# EAGLE design rev2 (EAGLE 6.4)
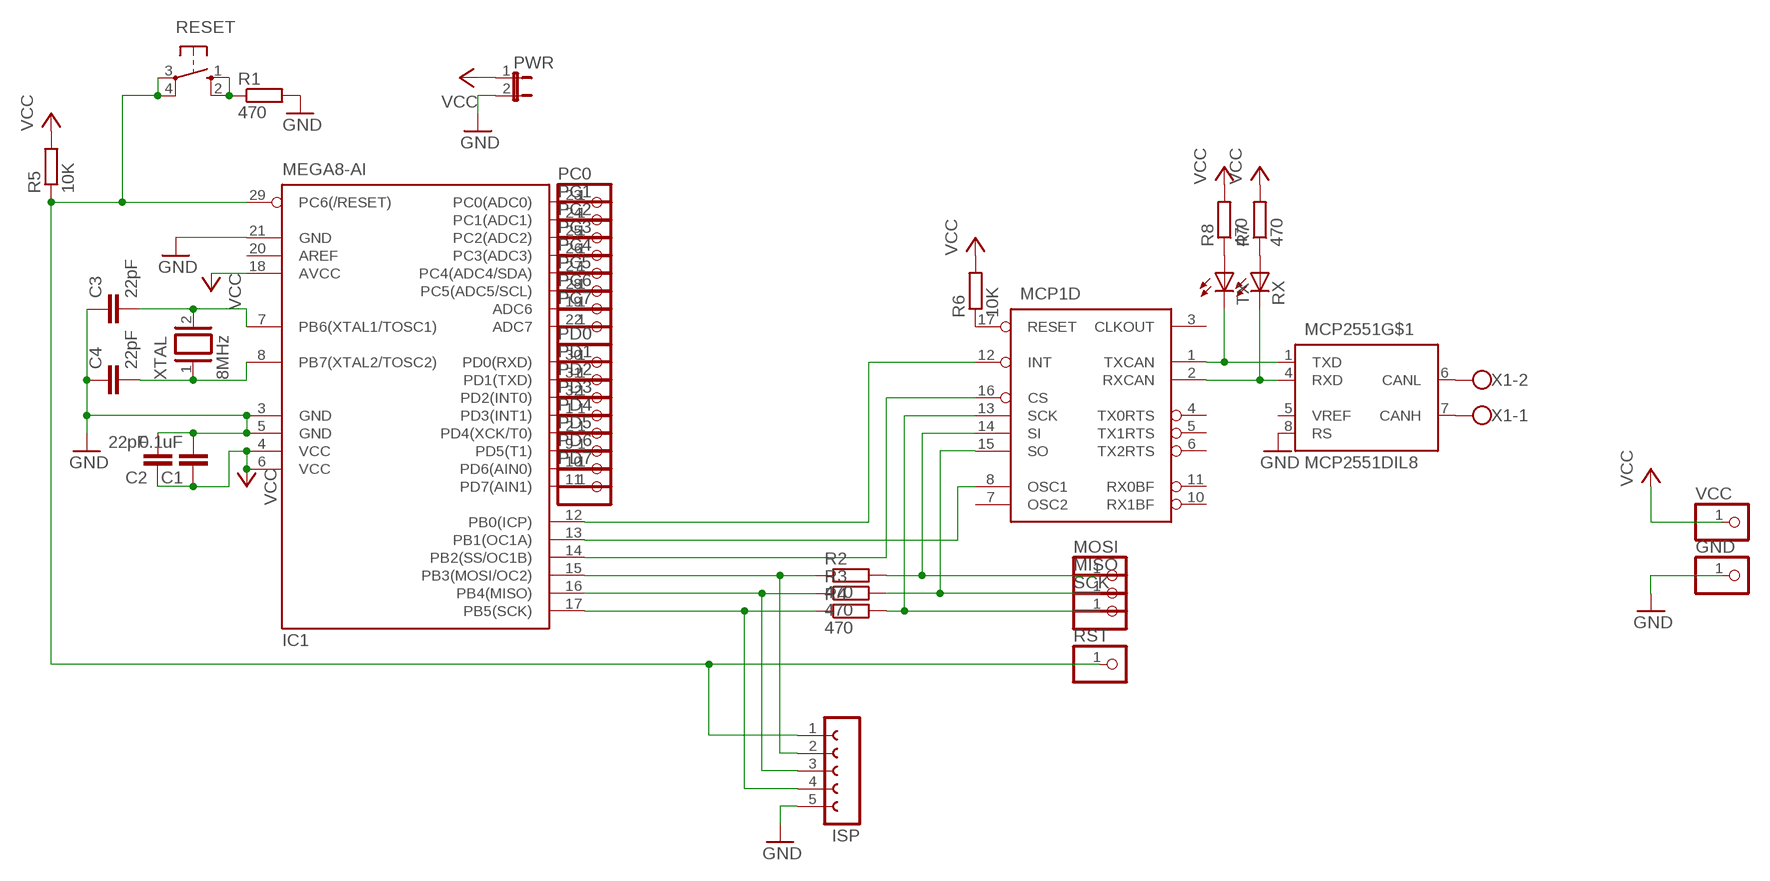
[diagram p0: schematic, sheet 1]

## Parts
C1  0.1uF  C-EUC0603  [C0603]
C2  22pF  C-EUC0603  [C0603]
C3  22pF  C-EUC0603  [C0603]
C4  22pF  C-EUC0603  [C0603]
GND  PINHD-1X1  [1X01]
IC1  MEGA8-AI  [TQFP32-08]
ISP  FE05-1  [FE05-1]
MCP1  MCP2515P  [DIL18]
MCP2551  MCP2551DIL8  [DIL08]
MISO  PINHD-1X1  [1X01]
MOSI  PINHD-1X1  [1X01]
PC0  PINHD-1X1  [1X01]
PC1  PINHD-1X1  [1X01]
PC2  PINHD-1X1  [1X01]
PC3  PINHD-1X1  [1X01]
PC4  PINHD-1X1  [1X01]
PC5  PINHD-1X1  [1X01]
PC6  PINHD-1X1  [1X01]
PC7  PINHD-1X1  [1X01]
PD0  PINHD-1X1  [1X01]
PD1  PINHD-1X1  [1X01]
PD2  PINHD-1X1  [1X01]
PD3  PINHD-1X1  [1X01]
PD4  PINHD-1X1  [1X01]
PD5  PINHD-1X1  [1X01]
PD6  PINHD-1X1  [1X01]
PD7  PINHD-1X1  [1X01]
PWR  JUMPER-2PTH  [1X02]
R1  470  R-EU_R0603  [R0603]
R2  470  R-EU_R0603  [R0603]
R3  470  R-EU_R0603  [R0603]
R4  470  R-EU_R0603  [R0603]
R5  10K  R-EU_R0603  [R0603]
R6  10K  R-EU_R0603  [R0603]
R7  470  R-EU_R0603  [R0603]
R8  470  R-EU_R0603  [R0603]
RESET  10-XX  [B3F-10XX]
RST  PINHD-1X1  [1X01]
RX  LEDCHIP-LED0603  [CHIP-LED0603]
SCK  PINHD-1X1  [1X01]
TX  LEDCHIP-LED0603  [CHIP-LED0603]
VCC  PINHD-1X1  [1X01]
X1  W237-102  [W237-102]
XTAL  8MHz  XTAL/S  [QS]

## Nets
GND: C1.2 C2.2 C3.1 C4.1 GND.1 IC1.3(GND) IC1.5(GND) IC1.21(GND) ISP.5 MCP2551.8(RS) PWR.2 R1.2
N$2: IC1.16(PB4(MISO)) ISP.3 R3.1
N$3: MCP1.14(D:SI) MOSI.1 R2.2
N$4: IC1.14(PB2(SS/OC1B)) MCP1.16(D:CS)
N$5: IC1.13(PB1(OC1A)) MCP1.8(D:OSC1)
N$7: MCP1.1(D:TXCAN) MCP2551.1(TXD) TX.C
N$9: C4.2 IC1.8(PB7(XTAL2/TOSC2)) XTAL.1
N$10: C3.2 IC1.7(PB6(XTAL1/TOSC1)) XTAL.2
N$12: MCP1.17(D:RESET) R6.1
N$13: R1.1 RESET.1(S) RESET.2(S1)
N$14: IC1.12(PB0(ICP)) MCP1.12(D:INT)
N$15: MCP1.13(D:SCK) R4.2 SCK.1
N$17: IC1.15(PB3(MOSI/OC2)) ISP.2 R2.1
N$18: R8.1 TX.A
N$19: R7.1 RX.A
N$20: IC1.23(PC0(ADC0)) PC0.1
N$21: IC1.24(PC1(ADC1)) PC1.1
N$22: IC1.25(PC2(ADC2)) PC2.1
N$23: IC1.26(PC3(ADC3)) PC3.1
N$24: IC1.27(PC4(ADC4/SDA)) PC4.1
N$25: IC1.28(PC5(ADC5/SCL)) PC5.1
N$26: IC1.19(ADC6) PC6.1
N$27: IC1.22(ADC7) PC7.1
N$28: IC1.30(PD0(RXD)) PD0.1
N$29: IC1.31(PD1(TXD)) PD1.1
N$30: IC1.32(PD2(INT0)) PD2.1
N$31: IC1.1(PD3(INT1)) PD3.1
N$32: IC1.2(PD4(XCK/T0)) PD4.1
N$33: IC1.9(PD5(T1)) PD5.1
N$34: IC1.10(PD6(AIN0)) PD6.1
N$35: IC1.11(PD7(AIN1)) PD7.1
N$36: MCP2551.6(CANL) X1.2
N$37: MCP2551.7(CANH) X1.1
N$38: MCP1.15(D:SO) MISO.1 R3.2
N$39: IC1.17(PB5(SCK)) ISP.4 R4.1
RESET: IC1.29(PC6(/RESET)) ISP.1 R5.1 RESET.3(P) RESET.4(P1) RST.1
RXLED: MCP1.2(D:RXCAN) MCP2551.4(RXD) RX.C
VCC: C1.1 C2.1 IC1.4(VCC) IC1.6(VCC) IC1.18(AVCC) PWR.1 R5.2 R6.2 R7.2 R8.2 VCC.1
Unconnected: IC1.20(AREF) MCP1.3(D:CLKOUT) MCP1.4(D:TX0RTS) MCP1.5(D:TX1RTS) MCP1.6(D:TX2RTS) MCP1.7(D:OSC2) MCP1.10(D:RX1BF) MCP1.11(D:RX0BF) MCP2551.5(VREF)

## Power pins joined to a net without a drawn wire
GND: MCP1.9(P:GND) MCP2551.2(GND)
VCC: MCP1.18(P:VCC) MCP2551.3(VCC)

## Library data of the parts
C1-C4 = resistor:C-EU: CAPACITOR, European symbol; OC_NEWARK: unknown
GND MISO MOSI PC0 PC1-PC7 PD0 PD1-PD7 RST SCK VCC = pinhead:PINHD-1X1: PIN HEADER
IC1 = atmel:MEGA8: MICROCONTROLLER 8 Kbytes FLASH, 1 kbytes SRAM, 512 bytes EEPROM, USART, 6-channel 10 bit ADC, 2-channel 8 bit ADC Pin compatible with Atmega48, ATMega88, ATMega168 Source: avr.lbr; MPN: ATMEGA8-16AU; OC_FARNELL: 9171371; OC_NEWARK: unknown
ISP = con-lsta:FE05-1: FEMALE HEADER; OC_FARNELL: unknown; OC_NEWARK: unknown
MCP1 = can:MCP2515: MC2515 Stand-Alone CAN Controller With SPI Interface, Microchip; OC_NEWARK: unknown
MCP2551 = can:MCP2551: CAN Tranceiver Microchip; OC_NEWARK: unknown
PWR = SparkFun-Passives:JUMPER-2: Jumper Basic 0.1" spaced jumper. Use with breakaway headers.
R1-R8 = resistor:R-EU_: RESISTOR, European symbol; OC_NEWARK: unknown
RESET = switch-omron:10-XX: OMRON SWITCH; MPN: B3F-1000; OC_FARNELL: 176432; OC_NEWARK: 36M3542
RX TX = led:LED: LED OSRAM: - CHIPLED LG R971, LG N971, LY N971, LG Q971, LY Q971, LO R971, LY R971 LH N974, LH R974 LS Q976, LO Q976, LY Q976 LO Q996 - Hyper CHIPLED LW Q18S LB Q993, LB Q99A, LB R99A - SideLED LS A670, LO A670, LY A670, LG A670, LP A670 LB A673, LV A673, LT A673, LW A673 LH A674 LY A675 LS A676, LA A676, LO A676, LY A676, LW A676 LS A679, LY A679, LG A679 - Hyper Micro SIDELED® LS Y876, LA Y876, LO Y876, LY Y876 LT Y87S - SmartLED LW L88C, LW L88S LB L89C, LB L89S, LG L890 LS L89K, LO L89K, LY L89K LS L896, LA L896, LO L896, LY L896 - TOPLED LS T670, LO T670, LY T670, LG T670, LP T670 LSG T670, LSP T670, LSY T670, LOP T670, LYG T670 LG T671, LOG T671, LSG T671 LB T673, LV T673, LT T673, LW T673 LH T674 LS T676, LA T676, LO T676, LY T676, LB T676, LH T676, LSB T676, LW T676 LB T67C, LV T67C, LT T67C, LS T67K, LO T67K, LY T67K, LW E67C LS E67B, LA E67B, LO E67B, LY E67B, LB E67C, LV E67C, LT E67C LW T67C LS T679, LY T679, LG T679 LS T770, LO T770, LY T770, LG T770, LP T770 LB T773, LV T773, LT T773, LW T773 LH T774 LS E675, LA E675, LY E675, LS T675 LS T776, LA T776, LO T776, LY T776, LB T776 LHGB T686 LT T68C, LB T68C - Hyper Mini TOPLED® LB M676 - Mini TOPLED Santana® LG M470 LS M47K, LO M47K, LY M47K Source: http://www.osram.convergy.de LUXEON: - LUMILED® LXK2-PW12-R00, LXK2-PW12-S00, LXK2-PW14-U00, LXK2-PW14-V00 LXK2-PM12-R00, LXK2-PM12-S00, LXK2-PM14-U00 LXK2-PE12-Q00, LXK2-PE12-R00, LXK2-PE12-S00, LXK2-PE14-T00, LXK2-PE14-U00 LXK2-PB12-K00, LXK2-PB12-L00, LXK2-PB12-M00, LXK2-PB14-N00, LXK2-PB14-P00, LXK2-PB14-Q00 LXK2-PR12-L00, LXK2-PR12-M00, LXK2-PR14-Q00, LXK2-PR14-R00 LXK2-PD12-Q00, LXK2-PD12-R00, LXK2-PD12-S00 LXK2-PH12-R00, LXK2-PH12-S00 LXK2-PL12-P00, LXK2-PL12-Q00, LXK2-PL12-R00 Source: www.luxeon.com KINGBRIGHT: KA-3528ASYC Source: www.kingbright.com
X1 = con-wago-500:W237-102: WAGO SCREW CLAMP; MPN: 237-102; OC_FARNELL: unknown; OC_NEWARK: 70K9898
XTAL = special:XTAL/S: CRYSTAL; OC_NEWARK: unknown

## Board
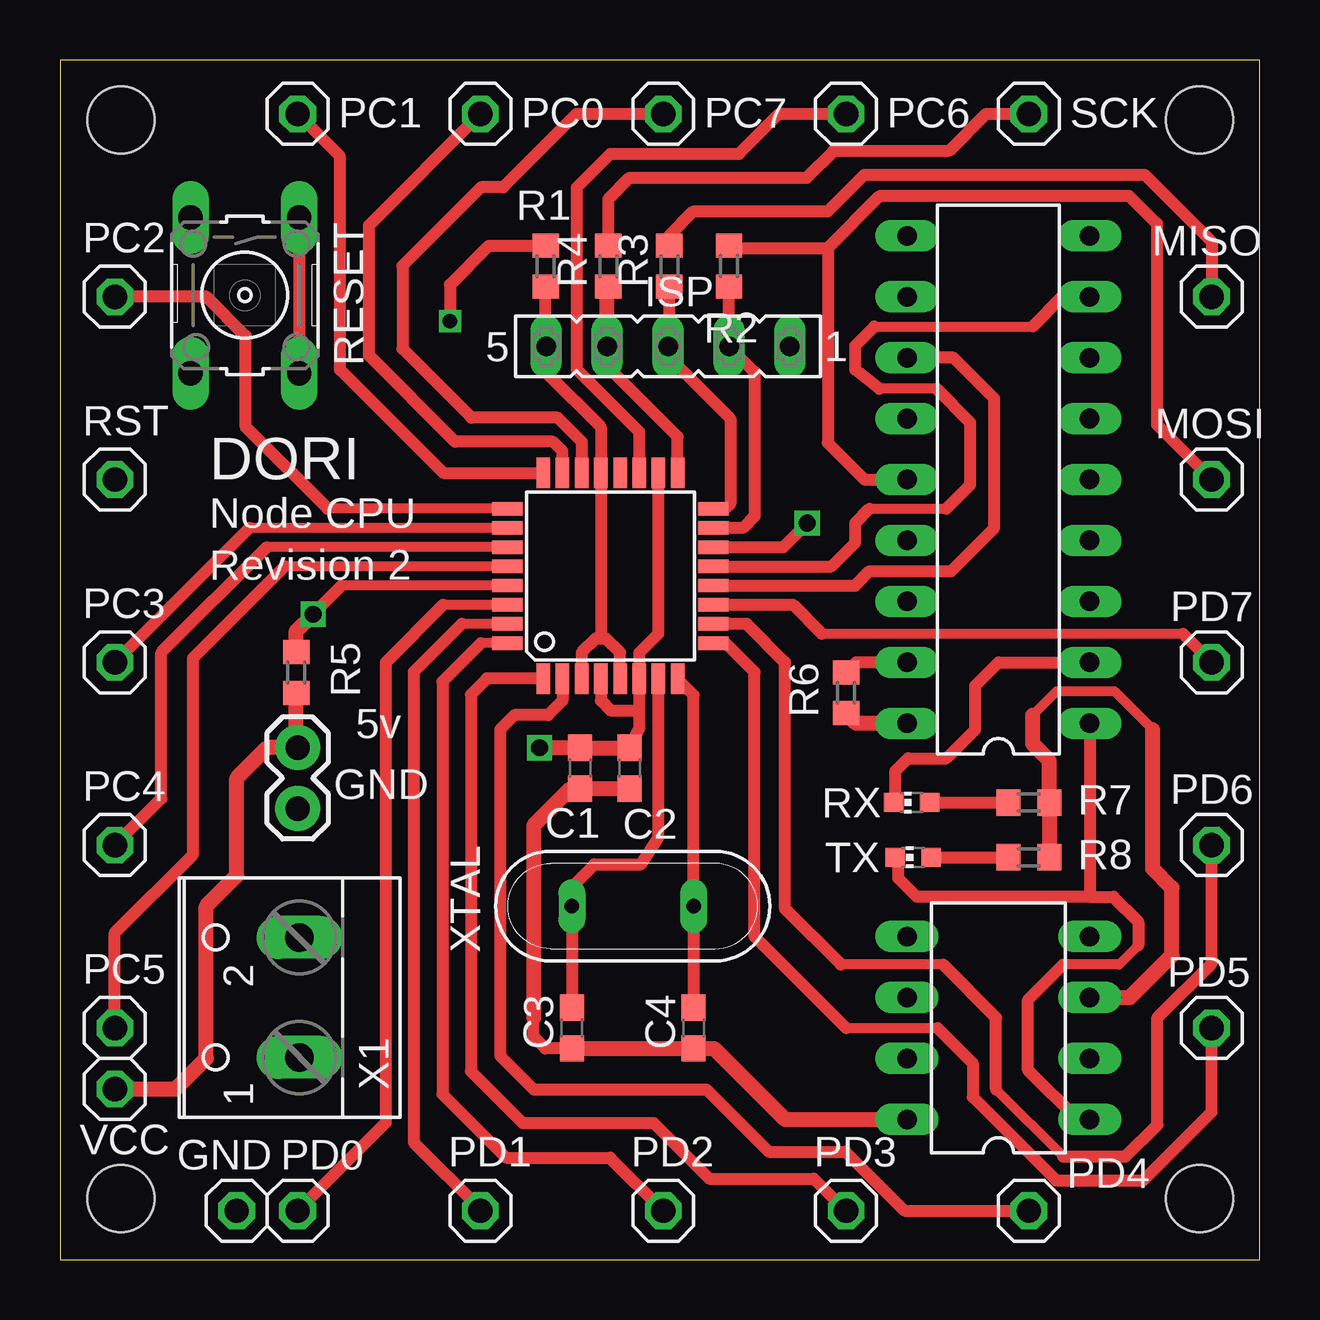
[diagram p1: board, top side]
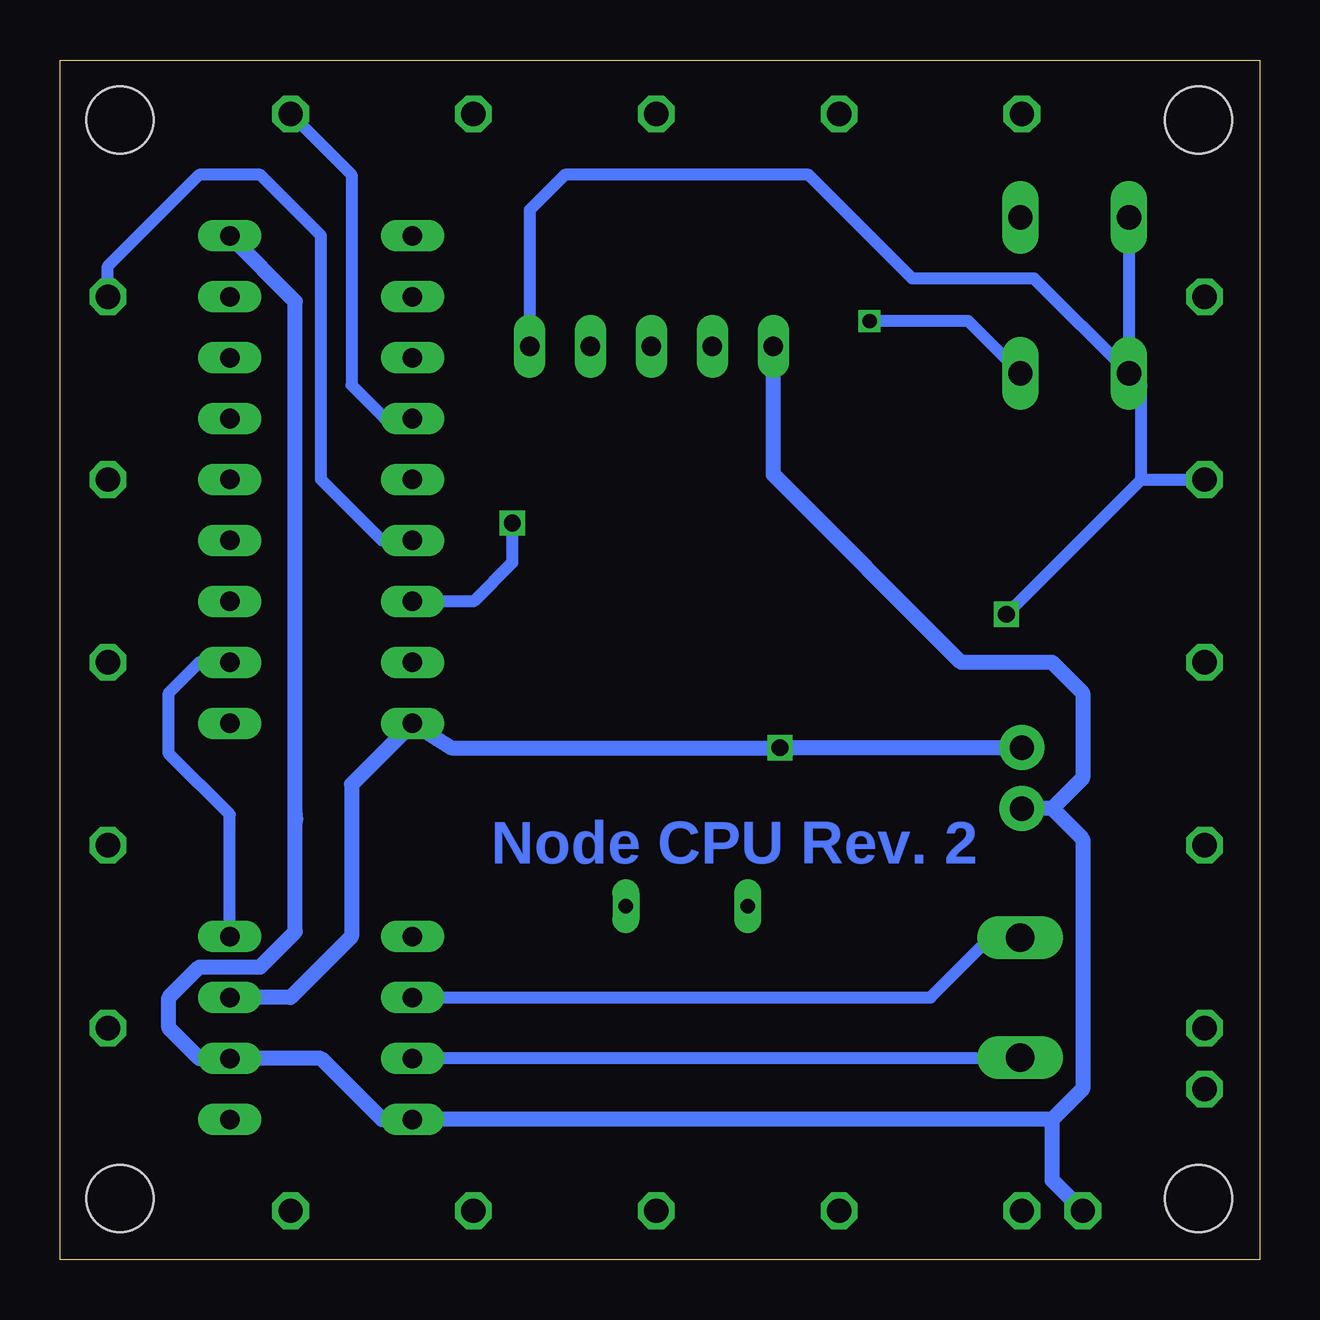
[diagram p2: board, bottom side, seen from below]

Size 50 x 50 mm. Coordinates in mm from the lower left corner, seen from the top.
Outline: 0,0 50,0 50,50 0,50 0,0
Copper layers (1*16): Top 0.035mm / dielectric 1.5mm / Bottom 0.035mm
Design rules "Fusion_eagle_rule_v1.1": minimum track width 6mil, minimum drill 12mil, track to track 6mil, track to pad 6mil, pad to pad 6mil, via to via 6mil, smd to smd 0mil, copper to edge 10mil, drill to drill 10mil, minimum pad ring 10mil, minimum via ring 6mil, stop-mask expansion 2mil, vias tented up to drill 100mil, thermal gap 10mil
Holes 2.8 mm at 2.54,47.5 47.5,47.5 47.5,2.54 2.54,2.54

### Footprints (pad centres in the part's own frame; a part is rotated, then mirrored left to right if it is on the bottom)
C0603 = smd 1.1 x 1: 1 -0.85,0; 2 0.85,0
1X01 = drill 1.016 octagon: 1 0,0
TQFP32-08 = smd 1.27 x 0.559: 1 -4.293,2.8; 2 -4.293,2; 3 -4.293,1.2; 4 -4.293,0.4; 5 -4.293,-0.4; 6 -4.293,-1.2; 7 -4.293,-2; 8 -4.293,-2.8; 17 4.293,-2.8; 18 4.293,-2; 19 4.293,-1.2; 20 4.293,-0.4; 21 4.293,0.4; 22 4.293,1.2; 23 4.293,2; 24 4.293,2.8 | smd 0.559 x 1.27: 9 -2.8,-4.293; 10 -2,-4.293; 11 -1.2,-4.293; 12 -0.4,-4.293; 13 0.4,-4.293; 14 1.2,-4.293; 15 2,-4.293; 16 2.8,-4.293; 25 2.8,4.293; 26 2,4.293; 27 1.2,4.293; 28 0.4,4.293; 29 -0.4,4.293; 30 -1.2,4.293; 31 -2,4.293; 32 -2.8,4.293
FE05-1 = drill 0.813 long: 1 -5.08,0; 2 -2.54,0; 3 0,0; 4 2.54,0; 5 5.08,0
DIL18 = drill 0.813 long: 1 -10.16,-3.81; 2 -7.62,-3.81; 3 -5.08,-3.81; 4 -2.54,-3.81; 5 0,-3.81; 6 2.54,-3.81; 7 5.08,-3.81; 8 7.62,-3.81; 9 10.16,-3.81; 10 10.16,3.81; 11 7.62,3.81; 12 5.08,3.81; 13 2.54,3.81; 14 0,3.81; 15 -2.54,3.81; 16 -5.08,3.81; 17 -7.62,3.81; 18 -10.16,3.81
DIL08 = drill 0.813 long: 1 -3.81,-3.81; 2 -1.27,-3.81; 3 1.27,-3.81; 4 3.81,-3.81; 5 3.81,3.81; 6 1.27,3.81; 7 -1.27,3.81; 8 -3.81,3.81
1X02 = drill 1.016 pad 1.88: 1 0,0; 2 2.54,0
R0603 = smd 1 x 1.1: 1 -0.85,0; 2 0.85,0
B3F-10XX = drill 1.016 long: 1 -3.251,2.261; 2 3.251,2.261; 3 -3.251,-2.261; 4 3.251,-2.261
CHIP-LED0603 = smd 0.8 x 0.8: A 0,-0.75; C 0,0.75
W237-102 = drill 1.194 long: 1 -2.5,-1.27; 2 2.5,-1.27
QS = drill 0.61 long: 1 -2.54,0; 2 2.54,0

### Placement (x,y rotation side)
C1  21.68,20.48 270 top
C2  23.75,20.48 270 top
C3  21.34,9.65 90 top
C4  26.42,9.65 90 top
GND  7.37,2.03 0 top
IC1  22.95,28.49 90 top
ISP  25.35,38.06 180 top
MCP1  39.12,32.51 90 top
MCP2551  39.12,9.65 90 top
MISO  48.01,40.13 0 top
MOSI  48.01,32.51 0 top
PC0  17.53,47.75 0 top
PC1  9.91,47.75 0 top
PC2  2.29,40.13 0 top
PC3  2.29,24.89 0 top
PC4  2.29,17.27 0 top
PC5  2.29,9.65 0 top
PC6  32.77,47.75 0 top
PC7  25.15,47.75 0 top
PD0  9.91,2.03 0 top
PD1  17.53,2.03 0 top
PD2  25.15,2.03 0 top
PD3  32.77,2.03 0 top
PD4  40.39,2.03 0 top
PD5  48.01,9.65 0 top
PD6  48.01,17.27 0 top
PD7  48.01,24.89 0 top
PWR  9.91,21.34 270 top
R1  20.25,41.4 270 top
R2  27.89,41.4 90 top
R3  25.4,41.4 90 top
R4  22.86,41.4 90 top
R5  9.85,24.47 270 top
R6  32.77,23.62 270 top
R7  40.39,19.05 0 top
R8  40.39,16.76 0 top
RESET  7.71,40.19 270 top
RST  2.29,32.51 0 top
RX  35.5,19.05 90 top
SCK  40.39,47.75 0 top
TX  35.57,16.76 90 top
VCC  2.29,7.11 0 top
X1  8.71,10.92 90 top
XTAL  23.88,14.73 180 top

### Tracks (layer width: path | path; a pad name or v marks a point on that pad's centre or on a via)
GND
  Top 0.508: IC1.3 21.75,25.29 22.35,25.89 22.55,25.89 | IC1.5 23.35,25.29 22.75,25.89 22.55,25.89 | 21.04,8.8 20.24,8.8 19.75,9.29 19.75,10.09 | 22.55,25.89 IC1.21 22.55,34.69 20.27,36.97 ISP.5 20.25,38.08 R1.2
  Top 0.635: 19.75,10.09 19.75,18.09 21.29,19.63 C1.2 C2.2 | 21.04,8.8 C3.1 C4.1 27.27,8.8 30.23,5.84 MCP2551.8
  Bottom 0.635: 40.19,18.54 40.19,18.27 | ISP.5 20.27,32.71 12.45,24.89 8.64,24.89 7.37,23.62 7.37,20.07 8.64,18.8 | 8.64,5.84 7.37,7.11 7.37,17.53 8.64,18.8 | 8.64,5.84 MCP2551.8 36.58,5.84 39.12,8.38 MCP2551.2 44.2,8.38 45.47,9.65 45.47,10.92 44.2,12.19 41.66,12.19 40.19,13.66 40.19,18.54 | 8.64,18.8 PWR.2 | GND.1 8.64,3.3 8.64,5.84 | 40.19,18.54 40.19,39.93 MCP1.9
N$2
  Top 0.508: IC1.16 27.74,31.29 27.94,31.5 27.94,35.05 25.4,37.59 25.4,38.01 ISP.3 25.4,38.12 R3.1
N$3
  Top 0.508: MOSI.1 45.72,34.8 45.72,43.18 44.56,44.34 34.18,44.34 32,42.16 | R2.2 27.94,42.16 32,42.16 | 32,42.16 32,34.04 33.53,32.51 MCP1.14
N$4  (via drill 0.7)
  Top 0.508: IC1.14 30.15,29.69 v31.15,30.69
  Bottom 0.508: v31.15,30.69 31.15,29.05 32.77,27.43 MCP1.16
N$5
  Top 0.406: 33.75,31.29 36.95,31.29 | 36.55,36.29 34.15,36.29 | 33.95,38.89 40.55,38.89
  Top 0.508: IC1.13 32.15,28.89 33.15,29.89 33.15,30.69 33.75,31.29 | 36.95,31.29 37.95,32.29 37.95,34.89 36.55,36.29 | 34.15,36.29 33.15,37.09 33.15,38.09 33.95,38.89 | 40.55,38.89 41.79,40.13 MCP1.8
N$7
  Top 0.406: 44.95,13.09 44.15,12.29 41.82,12.29
  Top 0.508: MCP1.1 42.93,15.12 | 44.95,13.09 44.95,14.09 43.92,15.12 42.93,15.12 | 41.82,12.29 40.35,10.82 40.35,7.89 42.4,5.84 MCP2551.1 | 42.93,15.12 35.72,15.12 34.95,15.89 34.95,16.63 TX.C
N$9
  Top 0.508: C4.2 XTAL.1 26.42,23.53 IC1.8
N$10
  Top 0.508: IC1.7 24.95,17.6 24.22,16.47 22.28,16.47 21.34,15.53 XTAL.2 C3.2
N$12
  Top 0.508: MCP1.17 33.19,24.89 R6.1
N$13  (via drill 0.6)
  Top 0.508: RESET.1 RESET.2 | v16.26,39.12 16.26,40.64 17.87,42.25 R1.1
  Bottom 0.508: RESET.2 12.14,39.12 v16.26,39.12
N$14
  Top 0.508: IC1.12 33.15,28.09 33.75,28.69 37.15,28.69 38.95,30.49 38.95,35.89 37.25,37.59 MCP1.12
N$15
  Top 0.508: SCK.1 38.61,47.75 37.08,46.23 32.26,46.23 31.11,45.09 23.75,45.09 22.86,44.2 R4.2
  Bottom 0.508: SCK.1 37.85,45.21 37.85,36.45 36.45,35.05 MCP1.13
N$17
  Top 0.508: IC1.15 28.46,30.49 28.96,30.99 28.96,36.99 ISP.2 R2.1
N$18
  Top 0.508: TX.A R8.1
N$19
  Top 0.508: RX.A R7.1
N$20
  Top 0.508: IC1.23 20.95,33.69 20.55,34.09 16.48,34.09 12.88,37.69 12.88,43.1 PC0.1
N$21
  Top 0.508: IC1.24 15.98,32.78 11.68,37.09 11.68,45.98 PC1.1
N$22
  Top 0.406: IC1.25 11.15,31.29
  Top 0.508: 2.33,40.09 PC2.1 6.11,40.13 7.75,38.49 7.75,34.69 11.15,31.29
N$23
  Top 0.406: IC1.26 7.89,30.49
  Top 0.508: 7.89,30.49 PC3.1
N$24
  Top 0.406: IC1.27 8.63,29.69
  Top 0.508: PC4.1 4.23,19.21 4.23,25.29 8.63,29.69
N$25
  Top 0.406: IC1.28 9.37,28.89
  Top 0.508: 9.37,28.89 5.55,25.07 5.55,16.89 2.29,13.63 PC5.1
N$26
  Top 0.508: IC1.19 24.15,34.49 21.55,37.09 21.55,44.69 22.95,46.09 28.31,46.09 29.97,47.75 PC6.1
N$27
  Top 0.508: IC1.22 21.75,34.09 20.75,35.09 17.15,35.09 14.28,37.96 14.28,41.42 17.55,44.69 18.48,44.69 21.54,47.75 PC7.1
N$28
  Top 0.406: 15.99,27.29 IC1.30
  Top 0.508: PD0.1 13.59,5.71 13.59,24.89 15.99,27.29
N$29
  Top 0.406: IC1.31 16.75,26.49
  Top 0.508: 16.75,26.49 14.75,24.49 14.75,4.89 17.53,2.11 PD1.1
N$30
  Top 0.406: IC1.32 17.55,25.69
  Top 0.508: 17.55,25.69 15.95,24.09 15.95,6.89 18.6,4.24 22.94,4.24 PD2.1
N$31
  Top 0.508: IC1.1 20.17,24.22 17.8,24.22 17.13,23.55 17.13,7.85 19.29,5.69 24.75,5.69 27.07,3.37 31.43,3.37 PD3.1
N$32
  Top 0.508: IC1.2 20.95,23.29 20.35,22.69 18.95,22.69 18.35,22.09 18.35,8.49 19.75,7.09 26.95,7.09 29.55,4.49 32.75,4.49 35.21,2.03 PD4.1
N$33
  Top 0.406: 32.77,9.65 36.58,9.65
  Top 0.508: IC1.9 27.75,25.69 28.96,24.48 28.96,13.46 32.77,9.65 | 36.58,9.65 38.05,8.18 38.05,6.77 41.53,3.29 45.15,3.29 48.01,6.15 PD5.1
N$34
  Top 0.406: 39.02,7.09 41.82,4.29 | 36.82,12.29 32.55,12.29
  Top 0.508: 41.82,4.29 44.42,4.29 45.75,5.62 45.75,10.09 48.01,12.35 PD6.1 | 39.02,7.09 39.02,10.09 36.82,12.29 | IC1.10 28.63,26.49 30.23,24.89 30.23,14.61 32.55,12.29
N$35
  Top 0.406: 31.75,26.09 46.81,26.09
  Top 0.508: IC1.11 30.55,27.29 31.75,26.09 | 46.81,26.09 PD7.1
N$36
  Bottom 0.508: MCP2551.6 13.72,10.92 11.22,13.42 X1.2
N$37
  Bottom 0.508: X1.1 11.22,8.38 MCP2551.7
N$38
  Top 0.508: MISO.1 48.01,42.42 45.21,45.21 33.53,45.21 32,43.69 26.42,43.69 25.4,42.67 R3.2
  Bottom 0.508: MCP1.15 36.58,29.97 39.12,32.51 39.12,42.67 41.66,45.21 44.2,45.21 48.01,41.4 MISO.1
N$39
  Top 0.508: IC1.17 25.75,34.29 22.81,37.23
  Top 0.635: 22.81,37.23 ISP.4 22.81,40.37 R4.1
RESET  (via drill 0.7)
  Top 0.406: IC1.29 11.74,28.09
  Top 0.508: 11.74,28.09 10.55,26.9 v10.55,26.89
  Top 0.635: R5.1 9.85,26.2 v10.55,26.89
  Bottom 0.508: 30.43,42.97 ISP.1 30.43,43.74 28.96,45.21 18.8,45.21 14.48,40.89 9.4,40.89 RESET.4 | v10.55,26.89 4.93,32.51 | 4.93,32.51 RST.1 | 4.93,32.51 4.93,36.42 RESET.4 | RESET.3 RESET.4
RXLED
  Top 0.508: MCP1.2 39.12,24.89 38.15,23.92 38.15,22.09 36.95,20.89 35.35,20.89 34.81,20.35 34.81,19.11 RX.C
  Bottom 0.508: MCP2551.4 42.93,18.54 45.47,21.08 45.47,23.62 44.2,24.89 MCP1.2
VCC  (via drill 0.7)
  Top 0.406: 40.55,22.69 41.55,23.69 43.95,23.69 45.55,22.09
  Top 0.508: C2.1 24.15,22.13 24.15,22.89 | 24.15,22.89 IC1.6 24.15,25.29 24.95,26.09 IC1.18 | 24.15,22.89 22.95,22.89 22.55,23.29 IC1.4
  Top 0.635: R8.2 R7.2 41.24,20.8 40.55,21.49 40.55,22.69 | MCP2551.3 44.6,10.92 46.35,12.67 46.35,15.49 45.55,16.29 45.55,22.09 | v19.99,21.33 C1.1 C2.1 | MCP1.18 33.19,22.35 R6.2 | VCC.1 4.83,7.11 6.1,8.38 6.1,14.73 7.37,16 7.37,20.07 8.64,21.34 PWR.1 9.85,21.39 R5.2
  Bottom 0.635: MCP2551.3 40.39,10.92 37.85,13.46 37.85,19.81 MCP1.18 33.69,21.33 v19.99,21.33 v19.98,21.34 PWR.1

### Text on the board
Bottom: Node CPU Rev. 2
tNames: DORI | Node CPU | Revision 2 | 5v | GND